# Altium project FEV-60_Motor_Driver.PrjPcb
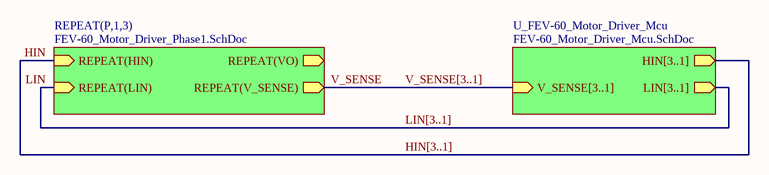
[diagram p0: FEV-60_Motor_Driver.SchDoc]
3 sheets, 88 parts. Net scope: hierarchical (ports join the sheet entries above them; power ports are global).
Board file: FEV-60_Motor_Driver.PcbDoc
Sheets:
  FEV-60_Motor_Driver.SchDoc
    P1 = FEV-60_Motor_Driver_Phase1.SchDoc
    P2 = FEV-60_Motor_Driver_Phase1.SchDoc
    P3 = FEV-60_Motor_Driver_Phase1.SchDoc
    U_FEV-60_Motor_Driver_Mcu = FEV-60_Motor_Driver_Mcu.SchDoc

## Sheet FEV-60_Motor_Driver.SchDoc
size B; Revision: A0

### Sub-sheets
REPEAT(P,1,3) = FEV-60_Motor_Driver_Phase1.SchDoc: REPEAT(HIN) (in), REPEAT(LIN) (in), REPEAT(V_SENSE) (out), REPEAT(VO) (out)
U_FEV-60_Motor_Driver_Mcu = FEV-60_Motor_Driver_Mcu.SchDoc: V_SENSE[3..1] (in), HIN[3..1] (out), LIN[3..1] (out)

### Nets
HIN: sheet REPEAT(P,1,3)/REPEAT(HIN)
LIN: sheet REPEAT(P,1,3)/REPEAT(LIN)
V_SENSE: sheet REPEAT(P,1,3)/REPEAT(V_SENSE)

### Buses and harness runs
bus HIN[3..1] = sheet U_FEV-60_Motor_Driver_Mcu/HIN[3..1]
bus LIN[3..1] = sheet U_FEV-60_Motor_Driver_Mcu/LIN[3..1]
bus V_SENSE[3..1] = sheet U_FEV-60_Motor_Driver_Mcu/V_SENSE[3..1]

### Notes on the sheet
- Title
- Date:
- Revision:
- Number:
- Team Skytanic
- Sheet
- of
- Senior Design
- 2019/2020
- File:

## Sheet FEV-60_Motor_Driver_Phase1.SchDoc
size B
Used 3 times, as channels P1, P2, P3. Parts and nets are listed once, with the designators drawn on the sheet.
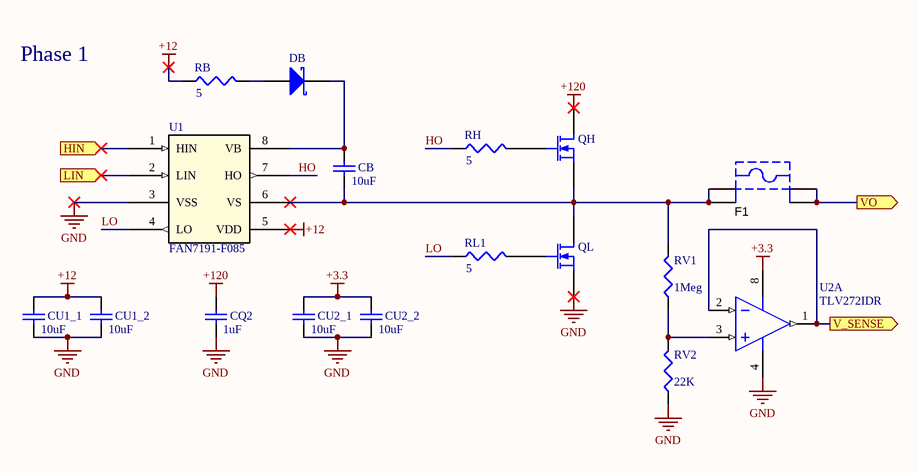
[diagram p1: FEV-60_Motor_Driver_Phase1.SchDoc]

### Parts
CB  value 10uF  [C1206]  (hidden comment: Cap Semi)
CQ2  1uF  [TDK-C5750-2_M]
CU1_1  value 10uF  [1608[0603]]  (hidden comment: Cap Semi)
CU1_2  value 10uF  [1608[0603]]  (hidden comment: Cap Semi)
CU2_1  value 10uF  [1608[0603]]  (hidden comment: Cap Semi)
CU2_2  value 10uF  [1608[0603]]  (hidden comment: Cap Semi)
DB  STPS2200U  [SMB]  (value not drawn)
F1  3568  [KSTN-3568_V]  (value not drawn)
QH  TPH2900ENH  [TPH2900ENH]  (value not drawn)
QL  TPH2900ENH  [TPH2900ENH]  (value not drawn)
RB  value 5  [J1-0603]  (hidden comment: Res3)
RH  value 5  [J1-0603]  (hidden comment: Res3)
RL1  value 5  [J1-0603]  (hidden comment: Res3)
RV1  value 1Meg  [J1-0603]  (hidden comment: Res3)
RV2  value 22K  [J1-0603]  (hidden comment: Res3)
U1  FAN7191-F085  [FAN7191-F085]
U2  TLV272IDR  [D0008A_M]  (part A of 2)

### Ports
HIN (in), LIN (in), V_SENSE (out), VO (out)

### Nets
+3.3: CU2_1.1 CU2_2.1 U2.8(VDD)
+12: CU1_1.1 CU1_2.1 RB.1 U1.5(VDD)
+120: CQ2.1 QH.1(D)
GND: CQ2.2 CU1_1.2 CU1_2.2 CU2_1.2 CU2_2.2 QL.3(S) RV2.1 U1.3(VSS) U2.4(GND)
HIN: U1.1(HIN) ; port HIN
HO: RH.1 U1.7(HO)
LIN: U1.2(LIN) ; port LIN
LO: RL1.1 U1.4(LO)
V_SENSE: U2.1(OUT1) U2.2(IN1-) ; port V_SENSE
VO: F1.3 F1.4 ; port VO
NetCB_1: CB.1 F1.1 F1.2 QH.3(S) QL.1(D) RV1.2 U1.6(VS)
NetCB_2: CB.2 DB.2(K) U1.8(VB)
NetDB_1: DB.1(A) RB.2
NetQH_2: QH.2(G) RH.2
NetQL_2: QL.2(G) RL1.2
NetRV1_1: RV1.1 RV2.2 U2.3(IN1+)

### Channels
P1: designators end in _P1; ports HIN=HIN1 LIN=LIN1 V_SENSE=V_SENSE1 VO=NetF1_P1_3
P2: designators end in _P2; ports HIN=HIN2 LIN=LIN2 V_SENSE=V_SENSE2 VO=NetF1_P2_3
P3: designators end in _P3; ports HIN=HIN3 LIN=LIN3 V_SENSE=V_SENSE3 VO=NetF1_P3_3

### Notes on the sheet
- Phase 1
- Title
- Date:
- Revision:
- Number:
- Team Skytanic
- Sheet
- of
- Senior Design
- 2019/2020
- File:

### Library data of the parts
CB = Cap Semi: Capacitor (Semiconductor SIM Model) at least 10-20uF; Published: 8-Jun-2000; LatestRevisionDate: 29-May-2009; LatestRevisionNote: IPC-7351 Footprint Added.; PackageReference: C1206; Publisher: Altium Limited; PackageDescription: Chip Capacitor
CQ2 = C5750X7R2E105K230KA: Chip Capacitor, 1 uF, +/- 20%, 250 V, -55 to 125 degC, 2220 (5750 Metric), RoHS, Tape and Reel; PCN Part Number: MLCCPartNumberChange30/Nov/2012; Manufacturer: TDK; Other Names: 445-5212-1; Featured Product: Compact,High-CapacitanceMultilayerCeramicChipCapacitorsMidVoltageX7S-100VMLCCsC-SeriesMidVoltageMLCCs; Product Training Modules: SEAT,CCV,andTVCLDesignToolsCSeriesMidVoltageCapacitorsFamilyGuidetoReplacinganElectrolyticCapacitorwithanMLCC; Kits: 445-9009-KIT-ND-KITCAPCERHICAP100V-630VSMDSAMPLEKIT1008-ND-KITCAPCERMLCC100V-630V; Catalog Drawings: CSERIES_2220_2.5; Online Catalog: CSeries,MidVoltage; Temperature Coefficient: X7S; Voltage - Rated: 100V; Capacitance: 10µF; Package Description: SMD, 2-Leads, Body 6.1 x 5.4 mm; Manufacturer URL: http://www.tdk.com/; Size / Dimension: 0.224"Lx0.197"W(5.70mmx5.00mm); RoHS Information: RoHSCertificate-MLCC; Package Reference: C5750-2; Applications: GeneralPurpose; Datasheet Version: 09/2013; Features: -; Datasheet URL: https://datasheet.ciiva.com/24216/c5750x7s2a106m230kb-265716-24216594.pdf; Standard Package: 1; Lead Spacing: -; Family: CeramicCapacitors; Thickness (Max): 0.098"(2.50mm); Packaging: CutTape(CT); Mounting Technology: SurfaceMount; Lead Style: -; Height - Seated (Max): -; Package / Case: 2220(5750Metric); Series: C; Category: Capacitors; Ratings: -; Operating Temperature: -55°C~125°C; Mounting Type: SurfaceMount,MLCC; Tolerance: ±20%
CU1_1 CU1_2 CU2_1 CU2_2 = Cap Semi: Capacitor (Semiconductor SIM Model); Published: 8-Jun-2000; LatestRevisionDate: 29-May-2009; LatestRevisionNote: IPC-7351 Footprint Added.; PackageReference: C1206; Publisher: Altium Limited; PackageDescription: Chip Capacitor
DB = D Schottky: Schottky Diode; Published: 8-Jun-2000; LatestRevisionDate: 17-Jul-2002; LatestRevisionNote: Re-released for DXP Platform.; PackageReference: SMB; Publisher: Altium Limited; PackageDescription: DO-214-AA/SMB; 2 C-Bend Leads; Body 5.3 x 3.6 mm, inc. leads (LxW); Code_JEDEC: DO-214-AA
F1 = CMP-2000-05464-1: Fuse Holder, 20 A, 500 V, -50 to 145 degC, 4-Pin THD, RoHS; Manufacturer: Keystone; Package Reference: 3568; Datasheet Version: 04/2013; Datasheet URL: https://datasheet.ciiva.com/16294/m60-2p40-16294706.pdf; Manufacturer URL: http://www.keyelco.com/; Mounting Technology: ThroughHole; Package Description: 4-Pin Through Hole Device, Body 16 x 6.73 mm, Pitch 9.9 mm
QH QL = TPH2900ENH: N-Channel 200V 33A (Ta) 78W (Tc) Surface Mount 8-SOP Advance (5x5); Manufacturer: Toshiba; Part Number: TPH2900ENHL1QCT-ND; ComponentLink1Description: TPH2900ENH; ComponentLink1URL: https://www.digikey.com/product-detail/en/toshiba-semiconductor-and-storage/TPH2900ENHL1Q/TPH2900ENHL1QCT-ND/5456291
RB RH RL1 RV1 RV2 = Res3: Resistor; Published: 8-Jun-2000; LatestRevisionDate: 29-May-2009; LatestRevisionNote: IPC-7351 Footprint Added.; PackageReference: J1-0603; Publisher: Altium Limited; PackageDescription: Chip Resistor
U1 = FAN7191-F085: 600 V / 4.5 A, High and Low / Side Automotive Gate / Driver IC; Manufacturer: On Semiconductor; ComponentLink1Description: Datasheet; ComponentLink1URL: https://www.onsemi.com/pub/Collateral/FAN7191_F085-D.PDF; Part Number: FAN7191-F085
U2 = CMP-0272-02013-3: 550 uA/Ch, 3 MHz, Rail-to-Rail Output Operational Amplifier, 2.7 to 16 V, -40 to 125 degC, 8-pin SOIC (D8), Green (RoHS & no Sb/Br); Manufacturer: Texas Instruments; Number of Channels: 2; Total Supply Voltage(Min)(+5V is 5, +/-5V is 10): 2.7; Vio (25C)(Max)(mV): 5; Total Supply Voltage(Max)(+5V is 5, +/-5V is 10): 16; Rating: Catalog; GBW(Typ)(MHz): 2.4; IIB(Max)(pA): 60; Packing: LARGE T&R; Iq per channel(Max)(mA): 0.56; CMRR(Min)(dB): 58; Sub Family: Low Supply Voltage Amplifier (<=2.7V), Precision Amplifier; Slew Rate(Typ)(V/us): 2.1; ComponentLink1Description: Manufacturer URL; PartNumber: TLV272IDR; ComponentLink2URL: http://www.ti.com/lit/ds/symlink/tlv272.pdf; PackageDescription: 8-Pin Plastic Small Outline, Body 4.9 x 3.9 mm, Pitch 1.27 mm; ComponentLink3Description: Package Specification; DatasheetVersion: SLOS351D; ComponentLink1URL: http://www.ti.com/; ComponentLink2Description: Datasheet; PackageVersion: 4040047-3/M, 06/2011; PackageReference: D0008A; Offset Drift(Typ)(uV/C): 2; Eco-Plan: Green (RoHS & no Sb/Br); Code_JEDEC: MS-012; ComponentLink3URL: http://www.ti.com/litv/pdf/msoi002j; Mounting Technology: Surface Mount

## Sheet FEV-60_Motor_Driver_Mcu.SchDoc
size B
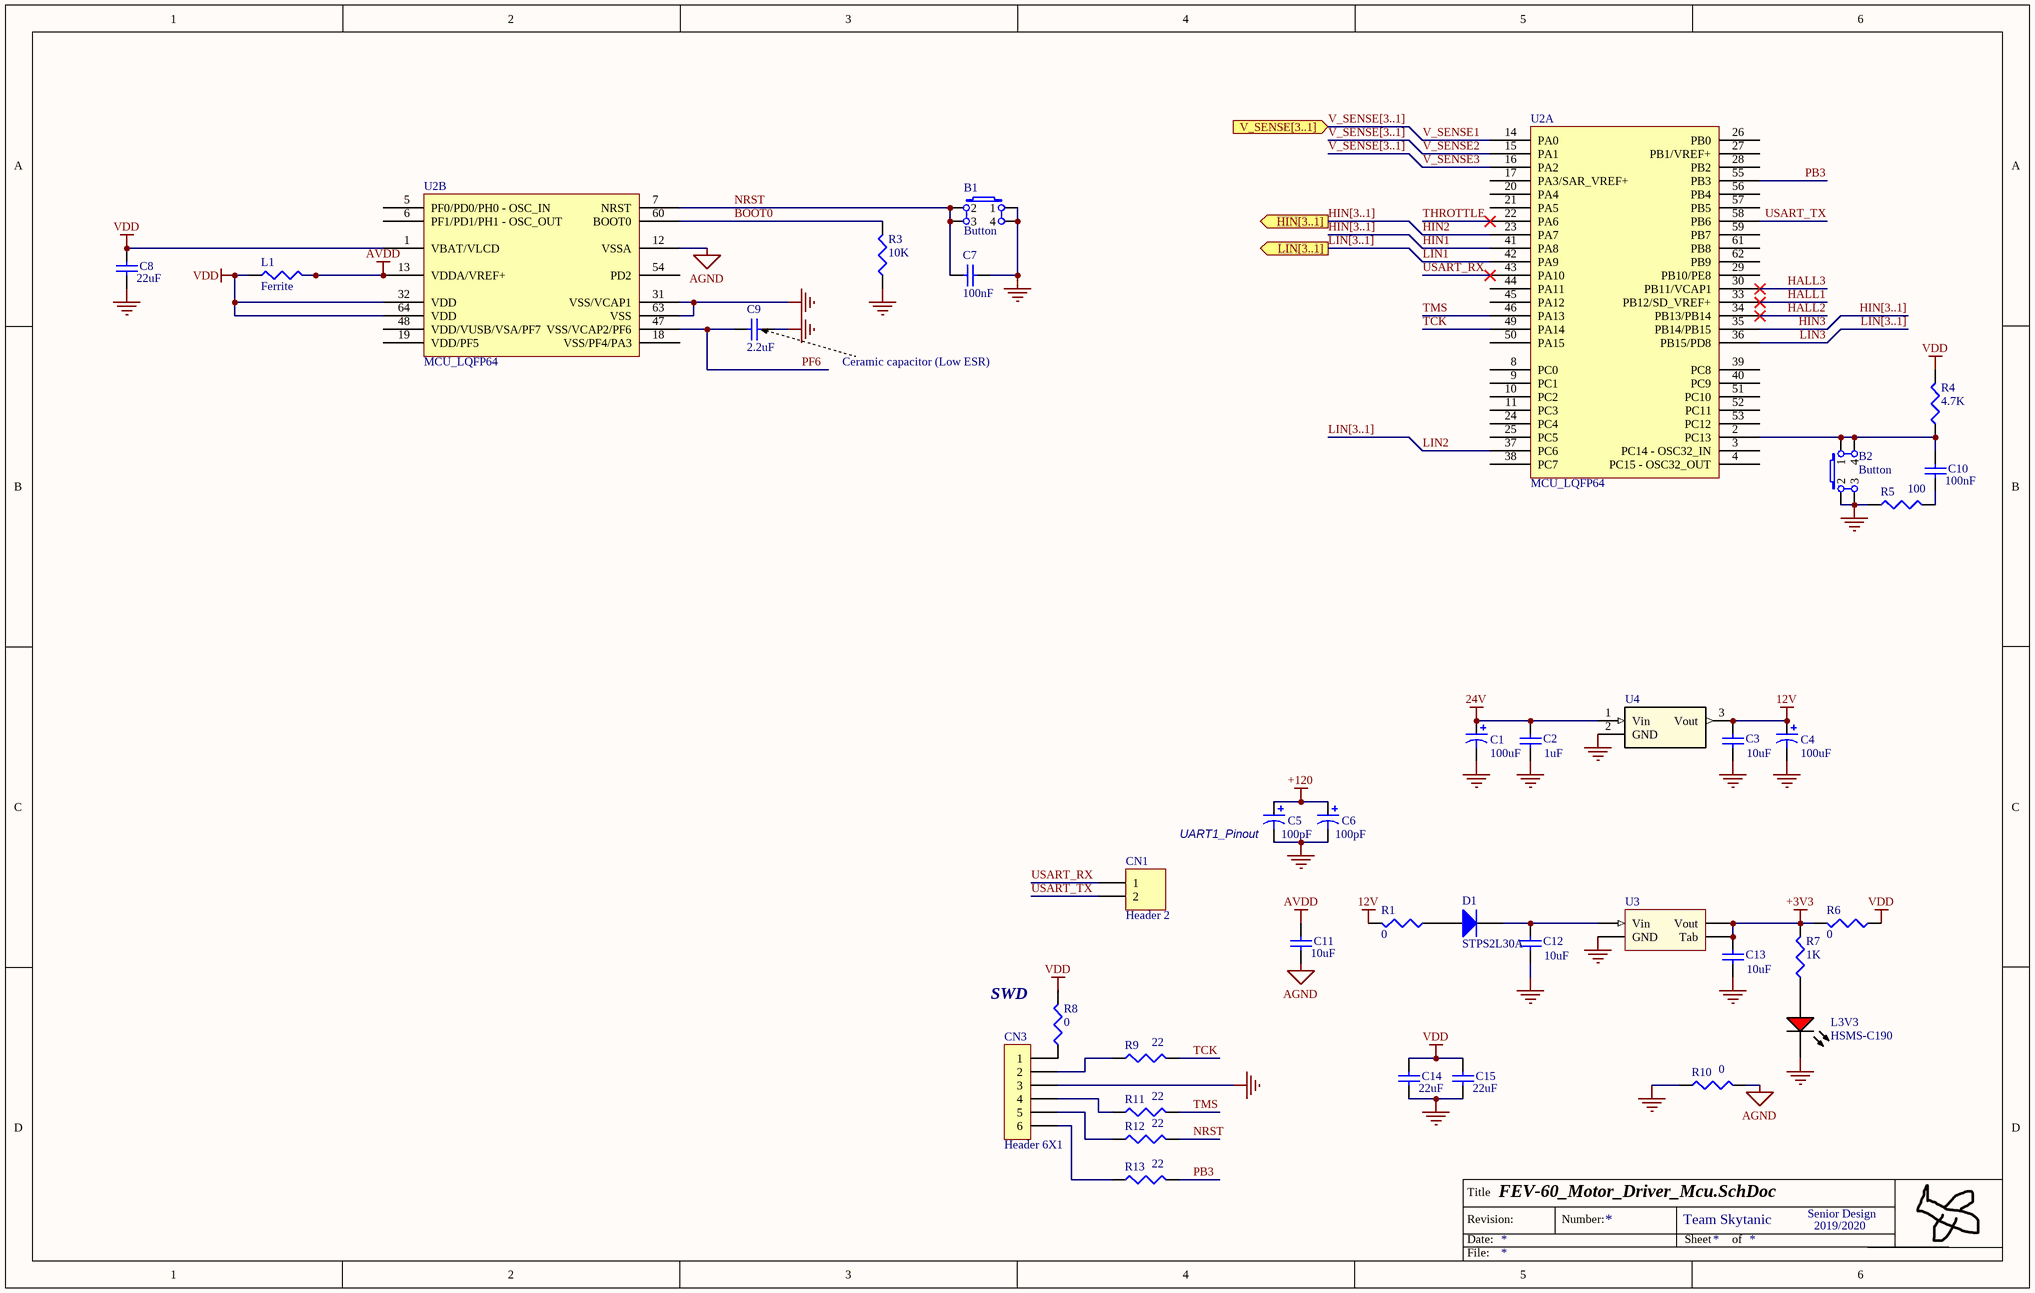
[diagram p2: FEV-60_Motor_Driver_Mcu.SchDoc]

### Parts
B1  Button  [Button - duplicate]
B2  Button  [Button - duplicate]
C1  value 100uF  [UVY1V101MED1TD]  (hidden comment: UVY1V101MED1TD)
C2  value 1uF  [1608[0603]]  (hidden comment: Cap Semi)
C3  value 10uF  [1608[0603]]  (hidden comment: Cap Semi)
C4  value 100uF  [UVY1V101MED1TD]  (hidden comment: UVY1V101MED1TD)
C5  value 100pF  [UCS2D151MHD1TN]  (hidden comment: UCS2D151MHD1TN)
C6  value 100pF  [UCS2D151MHD1TN]  (hidden comment: UCS2D151MHD1TN)
C7  value 100nF  [1608[0603]]  (hidden comment: Cap Semi)
C8  value 22uF  [1608[0603]]  (hidden comment: Cap Semi)
C9  value 2.2uF  [1608[0603]]  (hidden comment: Cap Semi)
C10  value 100nF  [1608[0603]]  (hidden comment: Cap Semi)
C11  value 10uF  [1608[0603]]  (hidden comment: Cap Semi)
C12  value 10uF  [1608[0603]]  (hidden comment: Cap Semi)
C13  value 10uF  [1608[0603]]  (hidden comment: Cap Semi)
C14  value 22uF  [1608[0603]]  (hidden comment: Cap Semi)
C15  value 22uF  [1608[0603]]  (hidden comment: Cap Semi)
CN1  Header 2  [HDR1X2]
CN3  Header 6X1  [HDR1X6]
D1  STPS2L30A  [STPS2L30A]
L1  Ferrite  [J1-0603]
L3V3  HSMS-C190  [AVAG-HSMX-C190_V]
R1  value 0  [J1-0603]  (hidden comment: Res3)
R3  value 10K  [J1-0603]  (hidden comment: Res3)
R4  value 4.7K  [J1-0603]  (hidden comment: Res3)
R5  value 100  [J1-0603]  (hidden comment: Res3)
R6  value 0  [J1-0603]  (hidden comment: Res3)
R7  value 1K  [J1-0603]  (hidden comment: Res3)
R8  value 0  [J1-0603]  (hidden comment: Res3)
R9  value 22  [J1-0603]  (hidden comment: Res3)
R10  value 0  [J1-0603]  (hidden comment: Res3)
R11  value 22  [J1-0603]  (hidden comment: Res3)
R12  value 22  [J1-0603]  (hidden comment: Res3)
R13  value 22  [J1-0603]  (hidden comment: Res3)
U2  MCU_LQFP64  [STM32F030R8 - duplicate]  (parts A,B of 2)
U3  LD1117S33TR  [LD1117S33TR - duplicate]  (value not drawn)
U4  UA78M12CKVURG3  [UA78M12CKVURG3]  (value not drawn)

### Ports
HIN[3..1] (out), LIN[3..1] (out), V_SENSE[3..1] (in)

### Nets
12V: C3.2 C4.1 R1.2 U4.3(Vout)
24V: C1.1 C2.2 U4.1(Vin)
+3V3: C13.2 R6.2 R7.2 U3.2(Vout) U3.4(Tab)
+120: C5.1 C6.1
AGND: C11.1 R10.2 U2.12(VSSA)
AVDD: C11.2 L1.2 U2.13(VDDA/VREF+)
GND: B1.1 B1.4 B2.2 B2.3 C1.2 C2.1 C3.1 C4.2 C5.2 C6.2 C7.1 C8.1 C9.1 C12.1 C13.1 C14.1 C15.1 CN3.3 L3V3.2(K) R3.1 R5.1 R10.1 U2.31(VSS/VCAP1) U2.63(VSS) U3.1(GND) U4.2(GND)
VDD: C8.2 C14.2 C15.2 L1.1 R4.2 R6.1 R8.2 U2.1(VBAT/VLCD) U2.32(VDD) U2.64(VDD)
BOOT0: R3.2 U2.60(BOOT0)
HALL1: U2.33(PB12/SD_VREF+)
HALL2: U2.34(PB13/PB14)
HALL3: U2.30(PB11/VCAP1)
HIN1: U2.41(PA8)
HIN2: U2.23(PA7)
HIN3: U2.35(PB14/PB15)
LIN1: U2.42(PA9)
LIN2: U2.37(PC6)
LIN3: U2.36(PB15/PD8)
NRST: B1.2 B1.3 C7.2 R12.2 U2.7(NRST)
PB3: R13.2 U2.55(PB3)
PF6: C9.2 U2.47(VSS/VCAP2/PF6)
TCK: R9.2 U2.49(PA14)
THROTTLE: U2.22(PA6)
TMS: R11.2 U2.46(PA13)
USART_RX: CN1.1 U2.43(PA10)
USART_TX: CN1.2 U2.58(PB6)
V_SENSE1: U2.14(PA0)
V_SENSE2: U2.15(PA1)
V_SENSE3: U2.16(PA2)
NetB2_1: B2.1 B2.4 C10.2 R4.1 U2.2(PC13)
NetC10_1: C10.1 R5.2
NetC12_2: C12.2 D1.2(K) U3.3(Vin)
NetCN3_1: CN3.1 R8.1
NetCN3_2: CN3.2 R9.1
NetCN3_4: CN3.4 R11.1
NetCN3_5: CN3.5 R12.1
NetCN3_6: CN3.6 R13.1
NetD1_1: D1.1(A) R1.1
NetL3V3_1: L3V3.1(A) R7.1

Not connected (* = marked no-connect by the designer): U2 3(PC14_-_OSC32_IN) 4(PC15_-_OSC32_OUT) 5(PF0/PD0/PH0_-_OSC_IN) 6(PF1/PD1/PH1_-_OSC_OUT) 8(PC0) 9(PC1) 10(PC2) 11(PC3) 17(PA3/SAR_VREF+) 18(VSS/PF4/PA3) 19(VDD/PF5) 20(PA4) 21(PA5) 24(PC4) 25(PC5) 26(PB0) 27(PB1/VREF+) 28(PB2) 29(PB10/PE8) 38(PC7) 39(PC8) 40(PC9) 44(PA11) 45(PA12) 48(VDD/VUSB/VSA/PF7) 50(PA15) 51(PC10) 52(PC11) 53(PC12) 54(PD2) 56(PB4) 57(PB5) 59(PB7) 61(PB8) 62(PB9)

### Buses and harness runs
bus HIN[3..1]
bus HIN[3..1] = port HIN[3..1]
bus LIN[3..1]
bus LIN[3..1] = port LIN[3..1]
bus V_SENSE[3..1]
bus V_SENSE[3..1] = port V_SENSE[3..1]

### Notes on the sheet
- Ceramic capacitor (Low ESR)
- (near CN1) UART1_Pinout
- SWD
- Title
- Date:
- Revision:
- Number:
- Team Skytanic
- Sheet
- of
- Senior Design
- 2019/2020
- File:

### Library data of the parts
C1 C4 = UVY1V101MED1TD: Polarized Capacitor (Axial); Published: 8-Jun-2000; LatestRevisionDate: 17-Jul-2002; LatestRevisionNote: Re-released for DXP Platform.; PackageReference: POLAR0.8; Publisher: Altium Limited; PackageDescription: Polarized Capacitor; 2 Leads
C2 C3 C7-C15 = Cap Semi: Capacitor (Semiconductor SIM Model); Published: 8-Jun-2000; LatestRevisionDate: 29-May-2009; LatestRevisionNote: IPC-7351 Footprint Added.; PackageReference: C1206; Publisher: Altium Limited; PackageDescription: Chip Capacitor
C5 C6 = UCS2D151MHD1TN: Polarized Capacitor (Axial); Published: 8-Jun-2000; LatestRevisionDate: 17-Jul-2002; LatestRevisionNote: Re-released for DXP Platform.; PackageReference: POLAR0.8; Publisher: Altium Limited; PackageDescription: Polarized Capacitor; 2 Leads
CN1 = Header 2: Header, 2-Pin; LatestRevisionDate: 17-Jul-2002; LatestRevisionNote: Re-released for DXP Platform.; Publisher: Altium Limited
CN3 = Header 6X1: Header, 6-Pin, Single row; LatestRevisionDate: 17-Jul-2002; LatestRevisionNote: Re-released for DXP Platform.; Publisher: Altium Limited
D1 = STPS2L30A: Manuf_1: STM; Provided: ST; Order: BAT60JFILM; ECCN_US/EU: EAR99/NEC; Revision: July-2002: Re-released for DXP Platform.; Manuf_Part_1: BAT60JFILM; Distrib: ST
L1 R1 R3-R13 = Res3: Resistor; Published: 8-Jun-2000; LatestRevisionDate: 29-May-2009; LatestRevisionNote: IPC-7351 Footprint Added.; PackageReference: J1-0603; Publisher: Altium Limited; PackageDescription: Chip Resistor
L3V3 = CMP-2000-06427-1: LED Uni-Color Red, 52 mW, 20 mA, -40 to 85 degC, 2-Pin SMD, RoHS, Tape and Reel; Manufacturer: Avago; Reverse Voltage: 5V; Viewing Angle: 170deg; High Brightness: No; Lens Type: ColorlessDiffused; DELETED: Compliant; Product Height (mm): 0.8mm; Dominant Wave Length: 626nm; Number of  Elements: 1; Chip Material: GaP; Lum Intensity: 10mcd; Product Length (mm): 1.6mm; Forward Voltage: 2.6V; Power Dissipation: 52W; Shape Type: Rectangular; Forward Current: 25mA; Peak Wavelength: 630nm; Test Current (It): 20mA; Main Category: ChipLED; Lens Dimensions: 1x0.8x0.5mm; Pin Count: 2; Package Reference: HSMX-C190; Mounting Technology: SurfaceMount; Mounting: SurfaceMount; Datasheet URL: http://docs.avagotech.com/docs/AV02-0551EN; Package Type: ChipLed; Operating Temperature Classification: Industrial; Datasheet Version: 03/2012; Operating Temp Range: -40Cto85C; Emitting Color: Red; Rad Hardened: No; Manufacturer URL: http://www.avagotech.com/; Luminous Intensity: 10mcd; Package Description: 2-Pin Surface Mount Device, Body 1.6 x 0.8 mm, Height 0.9 mm; Type: Uni-Color; Packaging: TapeandReel; Product Depth (mm): 0.8mm
U4 = UA78M12CKVURG3: No Description Available; Vendor: Texas Instruments; Built_By: EMA_UL_Team; Manufacturer_Part_Number: UA78M12CKVURG3; Manufacturer: Texas Instruments; Copyright: Copyright (C) 2018 Accelerated Designs. All rights reserved; RefDes: RefDes; Type: DEV; Value: Value; ComponentLink1Description: Digikey; ComponentLink1URL: https://www.digikey.com/product-detail/en/texas-instruments/UA78M12CKVURG3/296-19664-1-ND/1026434

## Nets that join several sheets
+3.3: P1 (CU2_1_P1.1 CU2_2_P1.1 U2_P1.8), P2 (CU2_1_P2.1 CU2_2_P2.1 U2_P2.8), P3 (CU2_1_P3.1 CU2_2_P3.1 U2_P3.8)
+12: P1 (CU1_1_P1.1 CU1_2_P1.1 RB_P1.1 U1_P1.5), P2 (CU1_1_P2.1 CU1_2_P2.1 RB_P2.1 U1_P2.5), P3 (CU1_1_P3.1 CU1_2_P3.1 RB_P3.1 U1_P3.5)
+120: P1 (CQ2_P1.1 QH_P1.1), P2 (CQ2_P2.1 QH_P2.1), P3 (CQ2_P3.1 QH_P3.1), FEV-60_Motor_Driver_Mcu (C5.1 C6.1)
GND: P1 (9 pins), P2 (9 pins), P3 (9 pins), FEV-60_Motor_Driver_Mcu (26 pins)
HIN1: P1 (U1_P1.1), FEV-60_Motor_Driver_Mcu (U2.41)
HIN2: P2 (U1_P2.1), FEV-60_Motor_Driver_Mcu (U2.23)
HIN3: P3 (U1_P3.1), FEV-60_Motor_Driver_Mcu (U2.35)
LIN1: P1 (U1_P1.2), FEV-60_Motor_Driver_Mcu (U2.42)
LIN2: P2 (U1_P2.2), FEV-60_Motor_Driver_Mcu (U2.37)
LIN3: P3 (U1_P3.2), FEV-60_Motor_Driver_Mcu (U2.36)
V_SENSE1: P1 (U2_P1.1 U2_P1.2), FEV-60_Motor_Driver_Mcu (U2.14)
V_SENSE2: P2 (U2_P2.1 U2_P2.2), FEV-60_Motor_Driver_Mcu (U2.15)
V_SENSE3: P3 (U2_P3.1 U2_P3.2), FEV-60_Motor_Driver_Mcu (U2.16)